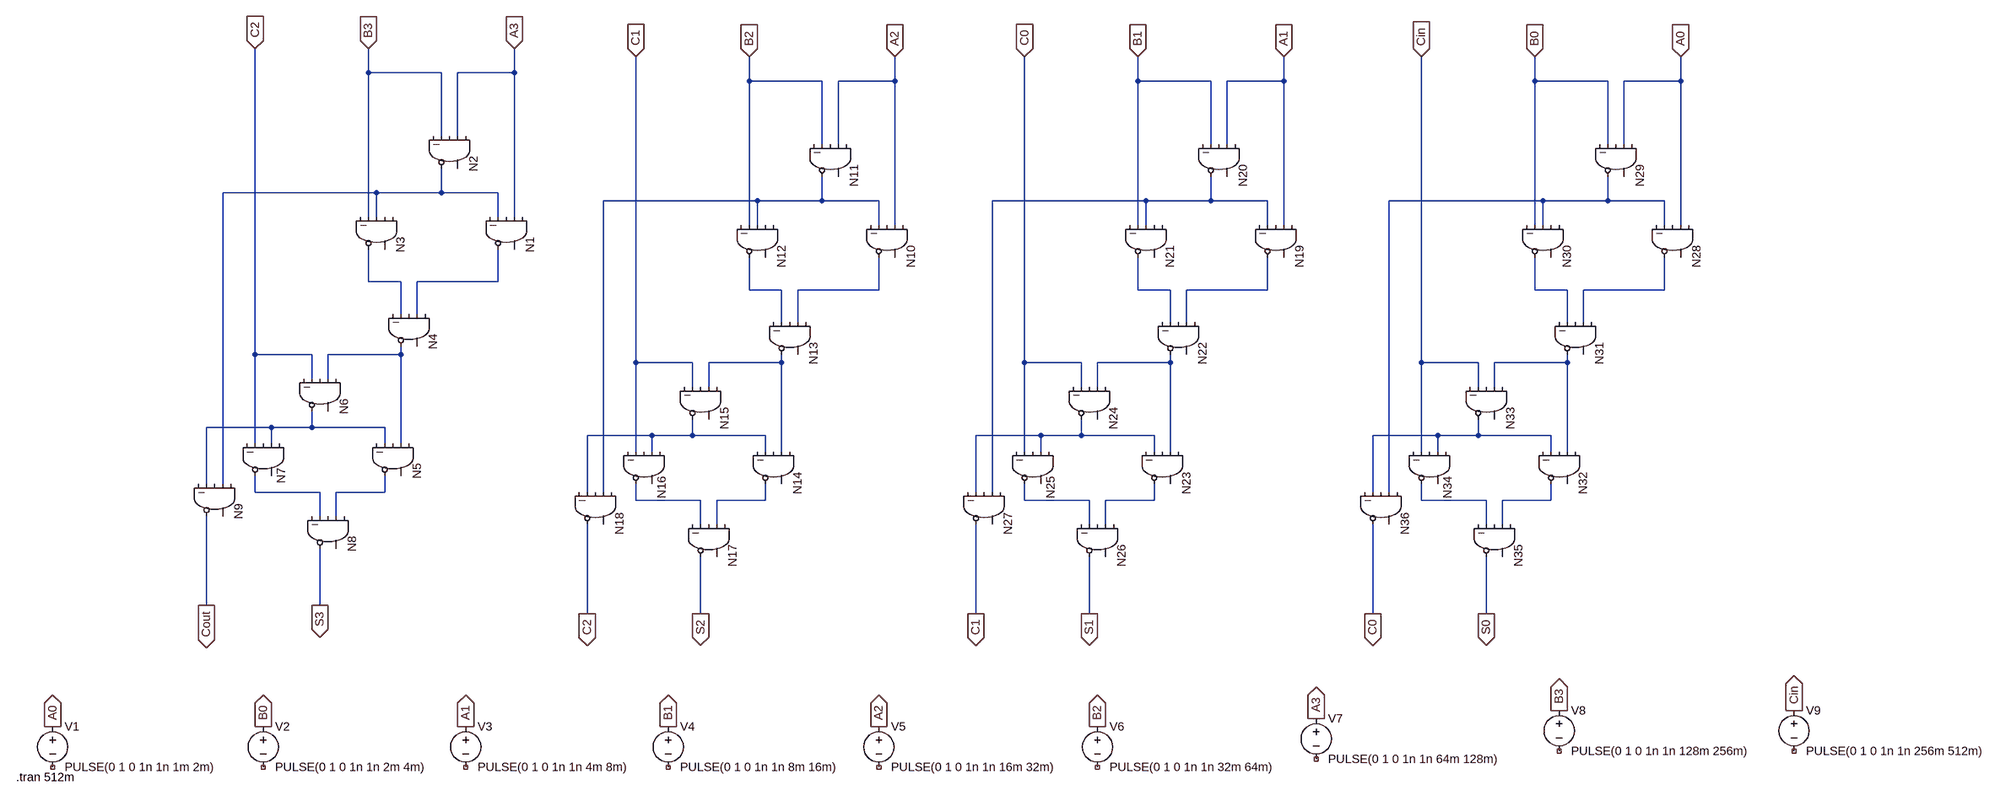
[diagram p0: schematic P2.asc]
P2.asc, the LTspice schematic file:
Version 4
SHEET 1 3372 1500
WIRE 160 -128 160 -176
WIRE 304 -128 160 -128
WIRE 448 -128 448 -176
WIRE 448 -128 336 -128
WIRE 912 -112 912 -160
WIRE 1056 -112 912 -112
WIRE 1200 -112 1200 -160
WIRE 1200 -112 1088 -112
WIRE 1680 -112 1680 -160
WIRE 1824 -112 1680 -112
WIRE 1968 -112 1968 -160
WIRE 1968 -112 1856 -112
WIRE 2464 -112 2464 -160
WIRE 2608 -112 2464 -112
WIRE 2752 -112 2752 -160
WIRE 2752 -112 2640 -112
WIRE 304 64 304 -128
WIRE 336 64 336 -128
WIRE 1056 80 1056 -112
WIRE 1088 80 1088 -112
WIRE 1824 80 1824 -112
WIRE 1856 80 1856 -112
WIRE 2608 80 2608 -112
WIRE 2640 80 2640 -112
WIRE 176 176 -128 176
WIRE 304 176 304 128
WIRE 304 176 176 176
WIRE 416 176 304 176
WIRE 928 192 624 192
WIRE 1056 192 1056 144
WIRE 1056 192 928 192
WIRE 1168 192 1056 192
WIRE 1696 192 1392 192
WIRE 1824 192 1824 144
WIRE 1824 192 1696 192
WIRE 1936 192 1824 192
WIRE 2480 192 2176 192
WIRE 2608 192 2608 144
WIRE 2608 192 2480 192
WIRE 2720 192 2608 192
WIRE 160 224 160 -128
WIRE 176 224 176 176
WIRE 416 224 416 176
WIRE 448 224 448 -128
WIRE 912 240 912 -112
WIRE 928 240 928 192
WIRE 1168 240 1168 192
WIRE 1200 240 1200 -112
WIRE 1680 240 1680 -112
WIRE 1696 240 1696 192
WIRE 1936 240 1936 192
WIRE 1968 240 1968 -112
WIRE 2464 240 2464 -112
WIRE 2480 240 2480 192
WIRE 2720 240 2720 192
WIRE 2752 240 2752 -112
WIRE 160 352 160 288
WIRE 224 352 160 352
WIRE 416 352 416 288
WIRE 416 352 256 352
WIRE 912 368 912 304
WIRE 976 368 912 368
WIRE 1168 368 1168 304
WIRE 1168 368 1008 368
WIRE 1680 368 1680 304
WIRE 1744 368 1680 368
WIRE 1936 368 1936 304
WIRE 1936 368 1776 368
WIRE 2464 368 2464 304
WIRE 2528 368 2464 368
WIRE 2720 368 2720 304
WIRE 2720 368 2560 368
WIRE 224 416 224 352
WIRE 256 416 256 352
WIRE 976 432 976 368
WIRE 1008 432 1008 368
WIRE 1744 432 1744 368
WIRE 1776 432 1776 368
WIRE 2528 432 2528 368
WIRE 2560 432 2560 368
WIRE -64 496 -64 -176
WIRE 48 496 -64 496
WIRE 224 496 224 480
WIRE 224 496 80 496
WIRE 688 512 688 -160
WIRE 800 512 688 512
WIRE 976 512 976 496
WIRE 976 512 832 512
WIRE 1456 512 1456 -160
WIRE 1568 512 1456 512
WIRE 1744 512 1744 496
WIRE 1744 512 1600 512
WIRE 2240 512 2240 -160
WIRE 2352 512 2240 512
WIRE 2528 512 2528 496
WIRE 2528 512 2384 512
WIRE 48 544 48 496
WIRE 80 544 80 496
WIRE 800 560 800 512
WIRE 832 560 832 512
WIRE 1568 560 1568 512
WIRE 1600 560 1600 512
WIRE 2352 560 2352 512
WIRE 2384 560 2384 512
WIRE -32 640 -160 640
WIRE 48 640 48 608
WIRE 48 640 -32 640
WIRE 192 640 48 640
WIRE 720 656 592 656
WIRE 800 656 800 624
WIRE 800 656 720 656
WIRE 944 656 800 656
WIRE 1488 656 1360 656
WIRE 1568 656 1568 624
WIRE 1568 656 1488 656
WIRE 1712 656 1568 656
WIRE 2272 656 2144 656
WIRE 2352 656 2352 624
WIRE 2352 656 2272 656
WIRE 2496 656 2352 656
WIRE -64 672 -64 496
WIRE -32 672 -32 640
WIRE 192 672 192 640
WIRE 224 672 224 496
WIRE 688 688 688 512
WIRE 720 688 720 656
WIRE 944 688 944 656
WIRE 976 688 976 512
WIRE 1456 688 1456 512
WIRE 1488 688 1488 656
WIRE 1712 688 1712 656
WIRE 1744 688 1744 512
WIRE 2240 688 2240 512
WIRE 2272 688 2272 656
WIRE 2496 688 2496 656
WIRE 2528 688 2528 512
WIRE -160 752 -160 640
WIRE -128 752 -128 176
WIRE -64 768 -64 736
WIRE 64 768 -64 768
WIRE 192 768 192 736
WIRE 192 768 96 768
WIRE 592 768 592 656
WIRE 624 768 624 192
WIRE 1360 768 1360 656
WIRE 1392 768 1392 192
WIRE 2144 768 2144 656
WIRE 2176 768 2176 192
WIRE 688 784 688 752
WIRE 816 784 688 784
WIRE 944 784 944 752
WIRE 944 784 848 784
WIRE 1456 784 1456 752
WIRE 1584 784 1456 784
WIRE 1712 784 1712 752
WIRE 1712 784 1616 784
WIRE 2240 784 2240 752
WIRE 2368 784 2240 784
WIRE 2496 784 2496 752
WIRE 2496 784 2400 784
WIRE 64 816 64 768
WIRE 96 816 96 768
WIRE 816 832 816 784
WIRE 848 832 848 784
WIRE 1584 832 1584 784
WIRE 1616 832 1616 784
WIRE 2368 832 2368 784
WIRE 2400 832 2400 784
WIRE -160 992 -160 816
WIRE 64 992 64 880
WIRE 592 1008 592 832
WIRE 816 1008 816 896
WIRE 1360 1008 1360 832
WIRE 1584 1008 1584 896
WIRE 2144 1008 2144 832
WIRE 2368 1008 2368 896
FLAG 448 -176 A3
IOPIN 448 -176 In
FLAG 160 -176 B3
IOPIN 160 -176 In
FLAG -64 -176 C2
IOPIN -64 -176 In
FLAG 64 992 S3
IOPIN 64 992 Out
FLAG -160 992 Cout
IOPIN -160 992 Out
FLAG 1200 -160 A2
IOPIN 1200 -160 In
FLAG 912 -160 B2
IOPIN 912 -160 In
FLAG 688 -160 C1
IOPIN 688 -160 In
FLAG 816 1008 S2
IOPIN 816 1008 Out
FLAG 592 1008 C2
IOPIN 592 1008 Out
FLAG 1968 -160 A1
IOPIN 1968 -160 In
FLAG 1680 -160 B1
IOPIN 1680 -160 In
FLAG 1456 -160 C0
IOPIN 1456 -160 In
FLAG 1584 1008 S1
IOPIN 1584 1008 Out
FLAG 1360 1008 C1
IOPIN 1360 1008 Out
FLAG 2752 -160 A0
IOPIN 2752 -160 In
FLAG 2464 -160 B0
IOPIN 2464 -160 In
FLAG 2240 -160 Cin
IOPIN 2240 -160 In
FLAG 2368 1008 S0
IOPIN 2368 1008 Out
FLAG 2144 1008 C0
IOPIN 2144 1008 Out
FLAG -48 1232 B0
IOPIN -48 1232 Out
FLAG 352 1232 A1
IOPIN 352 1232 Out
FLAG 752 1232 B1
IOPIN 752 1232 Out
FLAG 1168 1232 A2
IOPIN 1168 1232 Out
FLAG 1600 1232 B2
IOPIN 1600 1232 Out
FLAG 2032 1216 A3
IOPIN 2032 1216 Out
FLAG 2512 1200 B3
IOPIN 2512 1200 Out
FLAG -464 1232 A0
IOPIN -464 1232 Out
FLAG 2976 1200 Cin
IOPIN 2976 1200 Out
SYMBOL Digital\\and 496 256 R90
SYMATTR InstName N1
SYMBOL Digital\\and 384 96 R90
SYMATTR InstName N2
SYMBOL Digital\\and 240 256 R90
SYMATTR InstName N3
SYMBOL Digital\\and 304 448 R90
SYMATTR InstName N4
SYMBOL Digital\\and 272 704 R90
SYMATTR InstName N5
SYMBOL Digital\\and 128 576 R90
SYMATTR InstName N6
SYMBOL Digital\\and 16 704 R90
WINDOW 0 17 28 Left 2
SYMATTR InstName N7
SYMBOL Digital\\and 144 848 R90
SYMATTR InstName N8
SYMBOL Digital\\and -80 784 R90
SYMATTR InstName N9
SYMBOL Digital\\and 1248 272 R90
SYMATTR InstName N10
SYMBOL Digital\\and 1136 112 R90
SYMATTR InstName N11
SYMBOL Digital\\and 992 272 R90
SYMATTR InstName N12
SYMBOL Digital\\and 1056 464 R90
SYMATTR InstName N13
SYMBOL Digital\\and 1024 720 R90
SYMATTR InstName N14
SYMBOL Digital\\and 880 592 R90
SYMATTR InstName N15
SYMBOL Digital\\and 768 720 R90
WINDOW 0 17 28 Left 2
SYMATTR InstName N16
SYMBOL Digital\\and 896 864 R90
SYMATTR InstName N17
SYMBOL Digital\\and 672 800 R90
SYMATTR InstName N18
SYMBOL Digital\\and 2016 272 R90
SYMATTR InstName N19
SYMBOL Digital\\and 1904 112 R90
SYMATTR InstName N20
SYMBOL Digital\\and 1760 272 R90
SYMATTR InstName N21
SYMBOL Digital\\and 1824 464 R90
SYMATTR InstName N22
SYMBOL Digital\\and 1792 720 R90
SYMATTR InstName N23
SYMBOL Digital\\and 1648 592 R90
SYMATTR InstName N24
SYMBOL Digital\\and 1536 720 R90
WINDOW 0 17 28 Left 2
SYMATTR InstName N25
SYMBOL Digital\\and 1664 864 R90
SYMATTR InstName N26
SYMBOL Digital\\and 1440 800 R90
SYMATTR InstName N27
SYMBOL Digital\\and 2800 272 R90
SYMATTR InstName N28
SYMBOL Digital\\and 2688 112 R90
SYMATTR InstName N29
SYMBOL Digital\\and 2544 272 R90
SYMATTR InstName N30
SYMBOL Digital\\and 2608 464 R90
SYMATTR InstName N31
SYMBOL Digital\\and 2576 720 R90
SYMATTR InstName N32
SYMBOL Digital\\and 2432 592 R90
SYMATTR InstName N33
SYMBOL Digital\\and 2320 720 R90
WINDOW 0 17 28 Left 2
SYMATTR InstName N34
SYMBOL Digital\\and 2448 864 R90
SYMATTR InstName N35
SYMBOL Digital\\and 2224 800 R90
SYMATTR InstName N36
SYMBOL voltage -48 1216 R0
WINDOW 123 0 0 Left 0
WINDOW 39 0 0 Left 0
SYMATTR InstName V2
SYMATTR Value PULSE(0 1 0 1n 1n 2m 4m)
SYMBOL voltage 352 1216 R0
WINDOW 123 0 0 Left 0
WINDOW 39 0 0 Left 0
SYMATTR InstName V3
SYMATTR Value PULSE(0 1 0 1n 1n 4m 8m)
SYMBOL voltage 752 1216 R0
WINDOW 123 0 0 Left 0
WINDOW 39 0 0 Left 0
SYMATTR InstName V4
SYMATTR Value PULSE(0 1 0 1n 1n 8m 16m)
SYMBOL voltage 1168 1216 R0
WINDOW 123 0 0 Left 0
WINDOW 39 0 0 Left 0
SYMATTR InstName V5
SYMATTR Value PULSE(0 1 0 1n 1n 16m 32m)
SYMBOL voltage 1600 1216 R0
WINDOW 123 0 0 Left 0
WINDOW 39 0 0 Left 0
SYMATTR InstName V6
SYMATTR Value PULSE(0 1 0 1n 1n 32m 64m)
SYMBOL voltage 2032 1200 R0
WINDOW 123 0 0 Left 0
WINDOW 39 0 0 Left 0
SYMATTR InstName V7
SYMATTR Value PULSE(0 1 0 1n 1n 64m 128m)
SYMBOL voltage 2512 1184 R0
WINDOW 123 0 0 Left 0
WINDOW 39 0 0 Left 0
SYMATTR InstName V8
SYMATTR Value PULSE(0 1 0 1n 1n 128m 256m)
SYMBOL voltage -464 1216 R0
WINDOW 123 0 0 Left 0
WINDOW 39 0 0 Left 0
SYMATTR InstName V1
SYMATTR Value PULSE(0 1 0 1n 1n 1m 2m)
SYMBOL voltage 2976 1184 R0
WINDOW 123 0 0 Left 0
WINDOW 39 0 0 Left 0
SYMATTR InstName V9
SYMATTR Value PULSE(0 1 0 1n 1n 256m 512m)
TEXT -536 1332 Left 2 !.tran 512m

The netlist it stands for:
* P2.asc
A§N1 0 A3 0 N001 0 N006 0 0 AND
A§N2 0 A3 0 B3 0 N001 0 0 AND
A§N3 0 0 N001 B3 0 N005 0 0 AND
A§N4 0 N006 0 N005 0 N013 0 0 AND
A§N5 0 N013 0 N017 0 N022 0 0 AND
A§N6 0 N013 0 C2 0 N017 0 0 AND
A§N7 0 N017 0 C2 0 N021 0 0 AND
A§N8 0 N022 0 N021 0 S3 0 0 AND
A§N9 0 N001 0 N017 0 Cout 0 0 AND
A§N10 0 A2 0 N002 0 N008 0 0 AND
A§N11 0 A2 0 B2 0 N002 0 0 AND
A§N12 0 0 N002 B2 0 N007 0 0 AND
A§N13 0 N008 0 N007 0 N014 0 0 AND
A§N14 0 N014 0 N018 0 N024 0 0 AND
A§N15 0 N014 0 C1 0 N018 0 0 AND
A§N16 0 N018 0 C1 0 N023 0 0 AND
A§N17 0 N024 0 N023 0 S2 0 0 AND
A§N18 0 N002 0 N018 0 C2 0 0 AND
A§N19 0 A1 0 N003 0 N010 0 0 AND
A§N20 0 A1 0 B1 0 N003 0 0 AND
A§N21 0 0 N003 B1 0 N009 0 0 AND
A§N22 0 N010 0 N009 0 N015 0 0 AND
A§N23 0 N015 0 N019 0 N026 0 0 AND
A§N24 0 N015 0 C0 0 N019 0 0 AND
A§N25 0 N019 0 C0 0 N025 0 0 AND
A§N26 0 N026 0 N025 0 S1 0 0 AND
A§N27 0 N003 0 N019 0 C1 0 0 AND
A§N28 0 A0 0 N004 0 N012 0 0 AND
A§N29 0 A0 0 B0 0 N004 0 0 AND
A§N30 0 0 N004 B0 0 N011 0 0 AND
A§N31 0 N012 0 N011 0 N016 0 0 AND
A§N32 0 N016 0 N020 0 N028 0 0 AND
A§N33 0 N016 0 Cin 0 N020 0 0 AND
A§N34 0 N020 0 Cin 0 N027 0 0 AND
A§N35 0 N028 0 N027 0 S0 0 0 AND
A§N36 0 N004 0 N020 0 C0 0 0 AND
V2 B0 NC_01 PULSE(0 1 0 1n 1n 2m 4m)
V3 A1 NC_02 PULSE(0 1 0 1n 1n 4m 8m)
V4 B1 NC_03 PULSE(0 1 0 1n 1n 8m 16m)
V5 A2 NC_04 PULSE(0 1 0 1n 1n 16m 32m)
V6 B2 NC_05 PULSE(0 1 0 1n 1n 32m 64m)
V7 A3 NC_06 PULSE(0 1 0 1n 1n 64m 128m)
V8 B3 NC_07 PULSE(0 1 0 1n 1n 128m 256m)
V1 A0 NC_08 PULSE(0 1 0 1n 1n 1m 2m)
V9 Cin NC_09 PULSE(0 1 0 1n 1n 256m 512m)
.tran 512m
.backanno
.end